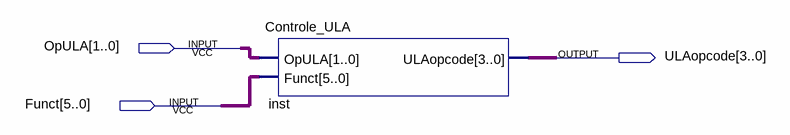
[diagram p0: schematic sheet]
// Quartus schematic Controle_ULA_test.bdf as structural Verilog: 1 symbols, 3 pins
module Controle_ULA_test (
  input  [1:0] OpULA,
  input  [5:0] Funct,
  output [3:0] ULAopcode
);

  Controle_ULA inst (.OpULA(OpULA), .Funct(Funct), .ULAopcode(ULAopcode));
endmodule
